# EAGLE design HAB (EAGLE 8.7.1)
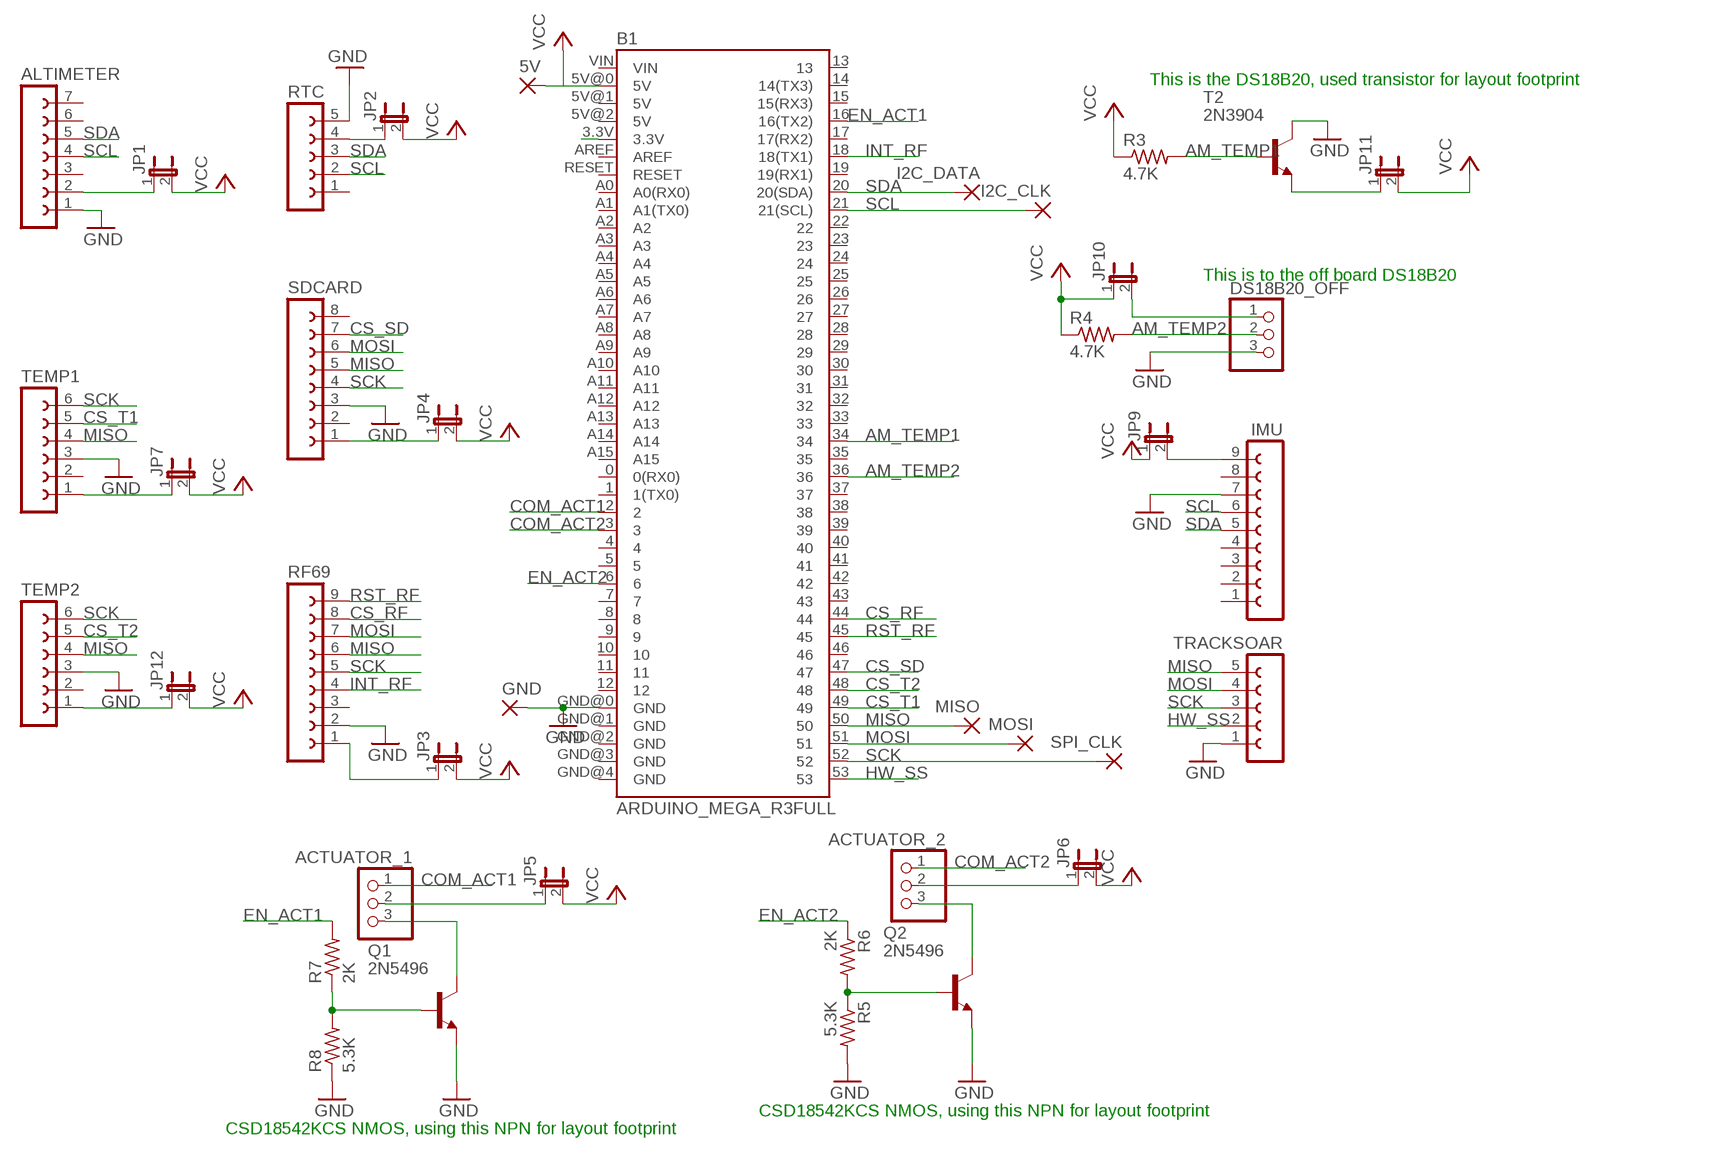
[diagram p0: schematic, sheet 1]

## Parts
5V  1,6/0,8  [1,6/0,8]
ACTUATOR_1  PINHD-1X3  [1X03]
ACTUATOR_2  PINHD-1X3  [1X03]
ALTIMETER  FE07-1  [FE07]
B1  ARDUINO_MEGA_R3FULL  [ARDUINO_MEGA]
DS18B20_OFF  PINHD-1X3  [1X03]
GND  1,6/0,8  [1,6/0,8]
I2C_CLK  1,6/0,8  [1,6/0,8]
I2C_DATA  1,6/0,8  [1,6/0,8]
IMU  FE09-1  [FE09]
JP1  JP1E  [JP1]
JP2  JP1E  [JP1]
JP3  JP1E  [JP1]
JP4  JP1E  [JP1]
JP5  JP1E  [JP1]
JP6  JP1E  [JP1]
JP7  JP1E  [JP1]
JP9  JP1E  [JP1]
JP10  JP1E  [JP1]
JP11  JP1E  [JP1]
JP12  JP1E  [JP1]
MISO  1,6/0,8  [1,6/0,8]
MOSI  1,6/0,8  [1,6/0,8]
Q1  2N5496  [TO220]
Q2  2N5496  [TO220]
R3  4.7K  R-US_0207/10  [0207/10]
R4  4.7K  R-US_0207/10  [0207/10]
R5  5.3K  R-US_0207/10  [0207/10]
R6  2K  R-US_0207/10  [0207/10]
R7  2K  R-US_0207/10  [0207/10]
R8  5.3K  R-US_0207/10  [0207/10]
RF69  FE09-1  [FE09]
RTC  FE05-1  [FE05-1]
SDCARD  FE08-1  [FE08]
SPI_CLK  1,6/0,8  [1,6/0,8]
T2  2N3904  [TO92]
TEMP1  FE06-1  [FE06]
TEMP2  FE06-1  [FE06]
TRACKSOAR  FE05-1  [FE05-1]

## Nets
AM_TEMP1: B1.34 R3.2 T2.2(B)
AM_TEMP2: B1.36 DS18B20_OFF.2 R4.2
COM_ACT1: ACTUATOR_1.1 B1.2
COM_ACT2: ACTUATOR_2.1 B1.3
CS_RF: B1.44 RF69.8
CS_SD: B1.47 SDCARD.7
CS_T1: B1.49 TEMP1.5
CS_T2: B1.48 TEMP2.5
EN_ACT1: B1.16(16(TX2)) R7.2
EN_ACT2: B1.6 R6.1
GND: ALTIMETER.1 B1.GND@0(GND) DS18B20_OFF.3 GND.1(P) IMU.7 Q1.3(E) Q2.3(E) R5.2 R8.1 RF69.2 RTC.5 SDCARD.3 T2.1(C) TEMP1.3 TEMP2.3 TRACKSOAR.1
HW_SS: B1.53 TRACKSOAR.2
INT_RF: B1.18(18(TX1)) RF69.4
MISO: B1.50 MISO.1(P) RF69.6 SDCARD.5 TEMP1.4 TEMP2.4 TRACKSOAR.5
MOSI: B1.51 MOSI.1(P) RF69.7 SDCARD.6 TRACKSOAR.4
N$1: Q2.1(B) R5.1 R6.2
N$2: DS18B20_OFF.1 JP10.2
N$3: ACTUATOR_2.3 Q2.2(C)
N$4: Q1.1(B) R7.1 R8.2
N$5: ACTUATOR_1.3 Q1.2(C)
N$6: JP3.1 RF69.1
N$7: JP7.1 TEMP1.1
N$8: JP12.1 TEMP2.1
N$11: ALTIMETER.2 JP1.1
N$12: JP2.1 RTC.4
N$13: JP4.1 SDCARD.1
N$16: ACTUATOR_1.2 JP5.1
N$17: ACTUATOR_2.2 JP6.1
N$20: IMU.9 JP9.2
N$25: JP11.1 T2.3(E)
N$29: B1.3.3V
RST_RF: B1.45 RF69.9
SCK: B1.52 RF69.5 SDCARD.4 SPI_CLK.1(P) TEMP1.6 TEMP2.6 TRACKSOAR.3
SCL: ALTIMETER.4 B1.21(21(SCL)) I2C_CLK.1(P) IMU.6 RTC.2
SDA: ALTIMETER.5 B1.20(20(SDA)) I2C_DATA.1(P) IMU.5 RTC.3
VCC: 5V.1(P) B1.5V@0(5V) JP1.2 JP2.2 JP3.2 JP4.2 JP5.2 JP6.2 JP7.2 JP9.1 JP10.1 JP11.2 JP12.2 R3.1 R4.1
Unconnected: ALTIMETER.3 ALTIMETER.6 ALTIMETER.7 B1.0(0(RX0)) B1.1(1(TX0)) B1.4 B1.5 B1.5V@1(5V) B1.5V@2(5V) B1.7 B1.8 B1.9 B1.10 B1.11 B1.12 B1.13 B1.14(14(TX3)) B1.15(15(RX3)) B1.17(17(RX2)) B1.19(19(RX1)) B1.22 B1.23 B1.24 B1.25 B1.26 B1.27 B1.28 B1.29 B1.30 B1.31 B1.32 B1.33 B1.35 B1.37 B1.38 B1.39 B1.40 B1.41 B1.42 B1.43 B1.46 B1.A0(A0(RX0)) B1.A1(A1(TX0)) B1.A2 B1.A3 B1.A4 B1.A5 B1.A6 B1.A7 B1.A8 B1.A9 B1.A10 B1.A11 B1.A12 B1.A13 B1.A14 B1.A15 B1.AREF B1.GND@1(GND) B1.GND@2(GND) B1.GND@3(GND) B1.GND@4(GND) B1.RESET B1.VIN IMU.1 IMU.2 IMU.3 IMU.4 IMU.8 RF69.3 RTC.1 SDCARD.2 SDCARD.8 TEMP1.2 TEMP2.2

## Notes on the sheet
- This is the DS18B20, used transistor for layout footprint
- This is to the off board DS18B20
- CSD18542KCS NMOS, using this NPN for layout footprint
- CSD18542KCS NMOS, using this NPN for layout footprint

## Library data of the parts
5V GND I2C_CLK I2C_DATA MISO MOSI SPI_CLK = wirepad:1,6/0,8: THROUGH-HOLE PAD
ACTUATOR_1 ACTUATOR_2 DS18B20_OFF = adafruit:PINHD-1X3: PIN HEADER
ALTIMETER = con-lsta:FE07-1: FEMALE HEADER; OC_FARNELL: unknown; OC_NEWARK: unknown
B1 = SparkFun-Boards:ARDUINO_MEGA_R3: Arduino Mega R3 ATmega2560 R3 compatible footprint. SparkFun Products: Arduino Mega 2560 R3 <https://www.sparkfun.com/products/11061>
IMU RF69 = con-lsta:FE09-1: FEMALE HEADER; OC_FARNELL: unknown; OC_NEWARK: unknown
JP1-JP7 JP9-JP12 = jumper:JP1E: JUMPER
Q1 Q2 = transistor-npn:2N5496: NPN Transistor
R3-R8 = rcl:R-US_: RESISTOR, American symbol; SPICEPREFIX: R
RTC TRACKSOAR = con-lsta:FE05-1: FEMALE HEADER; OC_FARNELL: unknown; OC_NEWARK: unknown
SDCARD = con-lsta:FE08-1: FEMALE HEADER; OC_FARNELL: unknown; OC_NEWARK: unknown
T2 = transistor:2N3904: NPN TRANSISTOR
TEMP1 TEMP2 = con-lsta:FE06-1: FEMALE HEADER; OC_FARNELL: unknown; OC_NEWARK: unknown

## Board
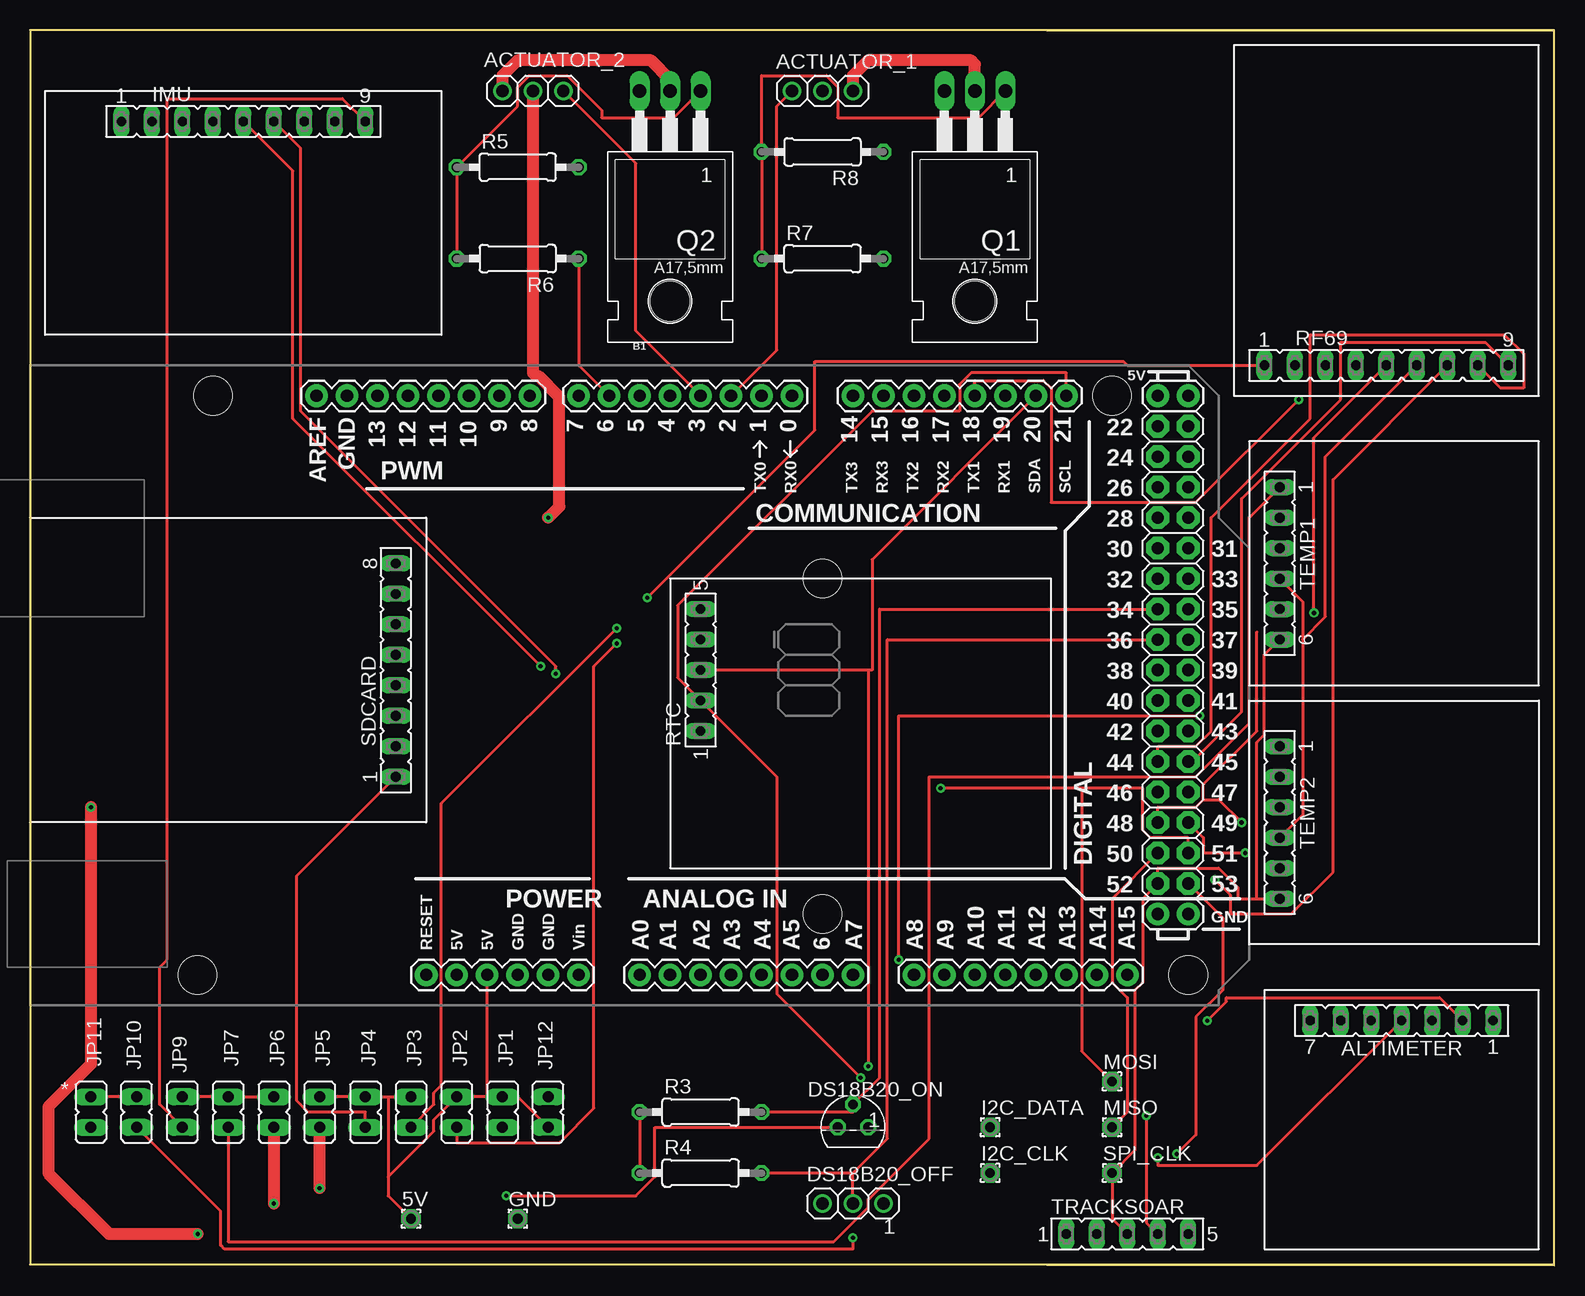
[diagram p1: board, top side]
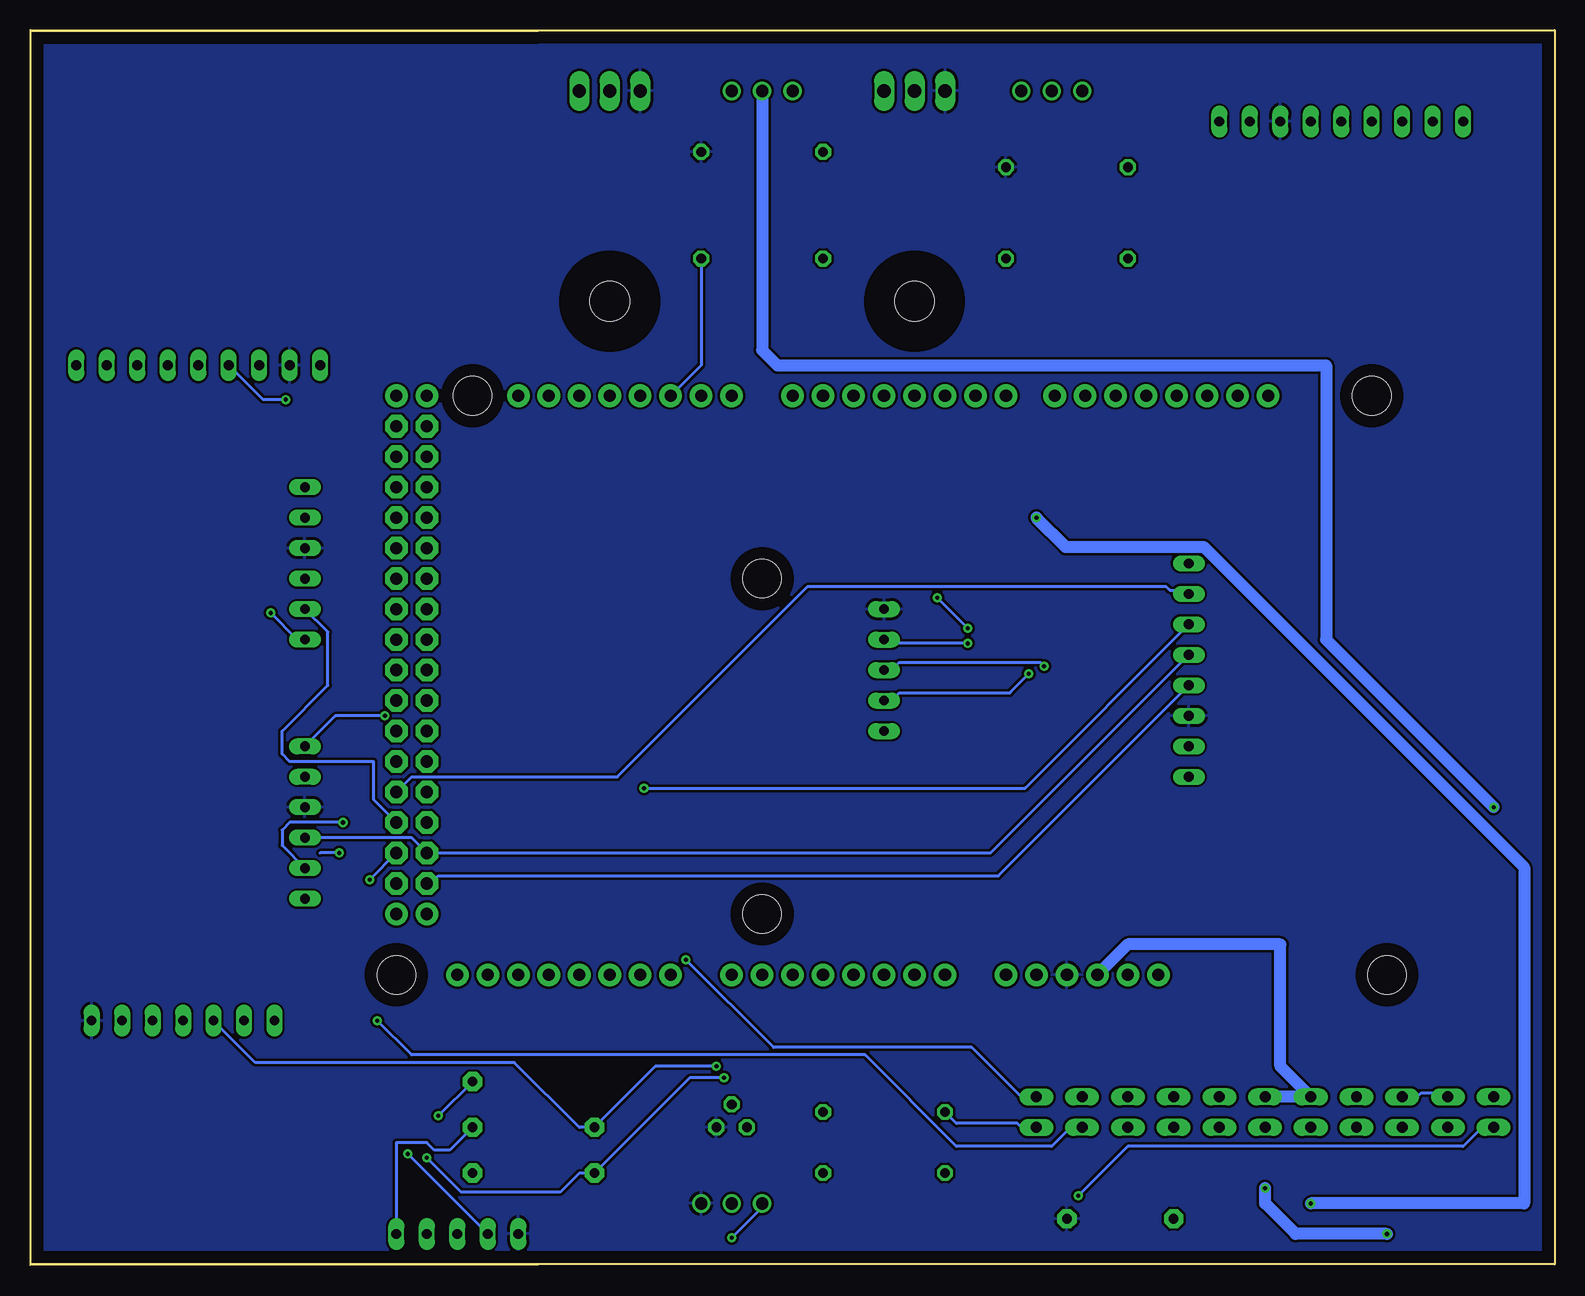
[diagram p2: board, bottom side, seen from below]

Size 127.05 x 103 mm. Coordinates in mm from the lower left corner, seen from the top.
Outline: 0,0.13 127.05,0 127.05,102.86 0,102.99 0,0.13
Outline: 0,0.13 0,103 127,103 127,0.13 0,0.13
Copper layers (1*16): Top 0.035mm / dielectric 1.5mm / Bottom 0.035mm
Design rules "default *": minimum track width 10mil, minimum drill 0.35mm, track to track 8mil, track to pad 8mil, pad to pad 8mil, via to via 8mil, smd to smd 6mil, copper to edge 40mil, drill to drill 6mil, minimum pad ring 10mil, minimum via ring 8mil, stop-mask expansion 4mil, vias tented up to drill 0mil, thermal gap 10mil

### Footprints (pad centres in the part's own frame; a part is rotated, then mirrored left to right if it is on the bottom)
1,6/0,8 = drill 0.813 pad 1.6 octagon: 1 0,0
1X03 = drill 1.016: 1 -2.54,0; 2 0,0; 3 2.54,0
FE07 = drill 0.813 long: 1 -7.62,0; 2 -5.08,0; 3 -2.54,0; 4 0,0; 5 2.54,0; 6 5.08,0; 7 7.62,0
ARDUINO_MEGA = drill 1.016 pad 1.88: 0 13.97,24.13; 1 11.43,24.13; 2 8.89,24.13; 3 6.35,24.13; 3.3V -13.97,-24.13; 4 3.81,24.13; 5 1.27,24.13; 5V@0 -11.43,-24.13; 5V@1 44.45,24.13; 5V@2 46.99,24.13; 6 -1.27,24.13; 7 -3.81,24.13; 8 -7.874,24.13; 9 -10.414,24.13; 10 -12.954,24.13; 11 -15.494,24.13; 12 -18.034,24.13; 13 -20.574,24.13; 14 19.05,24.13; 15 21.59,24.13; 16 24.13,24.13; 17 26.67,24.13; 18 29.21,24.13; 19 31.75,24.13; 20 34.29,24.13; 21 36.83,24.13; A0 1.27,-24.13; A1 3.81,-24.13; A2 6.35,-24.13; A3 8.89,-24.13; A4 11.43,-24.13; A5 13.97,-24.13; A6 16.51,-24.13; A7 19.05,-24.13; A8 24.13,-24.13; A9 26.67,-24.13; A10 29.21,-24.13; A11 31.75,-24.13; A12 34.29,-24.13; A13 36.83,-24.13; A14 39.37,-24.13; A15 41.91,-24.13; AREF -25.654,24.13; GND@0 -8.89,-24.13; GND@1 -6.35,-24.13; GND@2 44.45,-19.05; GND@3 46.99,-19.05; GND@4 -23.114,24.13; RESET -16.51,-24.13; VIN -3.81,-24.13 | drill 1.016 pad 1.88 octagon: 22 44.45,21.59; 23 46.99,21.59; 24 44.45,19.05; 25 46.99,19.05; 26 44.45,16.51; 27 46.99,16.51; 28 44.45,13.97; 29 46.99,13.97; 30 44.45,11.43; 31 46.99,11.43; 32 44.45,8.89; 33 46.99,8.89; 34 44.45,6.35; 35 46.99,6.35; 36 44.45,3.81; 37 46.99,3.81; 38 44.45,1.27; 39 46.99,1.27; 40 44.45,-1.27; 41 46.99,-1.27; 42 44.45,-3.81; 43 46.99,-3.81; 44 44.45,-6.35; 45 46.99,-6.35; 46 44.45,-8.89; 47 46.99,-8.89; 48 44.45,-11.43; 49 46.99,-11.43; 50 44.45,-13.97; 51 46.99,-13.97; 52 44.45,-16.51; 53 46.99,-16.51 | hole 3.2: -34.29,24.13; -35.56,-24.13; 16.51,8.89; 16.51,-19.05; 40.64,24.13; 46.99,-24.13
FE09 = drill 0.813 long: 1 -10.16,0; 2 -7.62,0; 3 -5.08,0; 4 -2.54,0; 5 0,0; 6 2.54,0; 7 5.08,0; 8 7.62,0; 9 10.16,0
JP1 = drill 0.914 long: 1 0,-1.27; 2 0,1.27
TO220 = drill 1.118 long: 1 -2.54,-6.35; 2 0,-6.35; 3 2.54,-6.35 | hole 3.302: 0,11.176
0207/10 = drill 0.813 octagon: 1 -5.08,0; 2 5.08,0
FE05-1 = drill 0.813 long: 1 -5.08,0; 2 -2.54,0; 3 0,0; 4 2.54,0; 5 5.08,0
FE08 = drill 0.813 long: 1 -8.89,0; 2 -6.35,0; 3 -3.81,0; 4 -1.27,0; 5 1.27,0; 6 3.81,0; 7 6.35,0; 8 8.89,0
TO92 = drill 0.813 octagon: 1 1.27,0; 2 0,1.905; 3 -1.27,0
FE06 = drill 0.813 long: 1 -6.35,0; 2 -3.81,0; 3 -1.27,0; 4 1.27,0; 5 3.81,0; 6 6.35,0

### Placement (x,y rotation side)
5V  31.75,3.94 0 top
ACTUATOR_1  66.04,97.92 0 top
ACTUATOR_2  41.91,97.92 180 top
ALTIMETER  114.3,20.45 180 top
B1  49.53,48.39 0 top
DS18B20_OFF  68.58,5.21 0 top
GND  40.64,3.94 0 top
I2C_CLK  80.01,7.75 0 top
I2C_DATA  80.01,11.56 0 top
IMU  17.78,95.38 0 top
JP1  39.37,12.83 0 top
JP2  35.56,12.83 0 top
JP3  31.75,12.83 0 top
JP4  27.94,12.83 0 top
JP5  24.13,12.83 0 top
JP6  20.32,12.83 0 top
JP7  16.51,12.83 0 top
JP9  12.7,12.83 180 top
JP10  8.89,12.83 180 top
JP11  5.08,12.83 0 top
JP12  43.18,12.83 180 top
MISO  90.17,11.56 0 top
MOSI  90.17,15.37 0 top
Q1  78.74,91.57 180 top
Q2  53.34,91.57 180 top
R3  55.88,12.83 0 top
R4  55.88,7.75 0 top
R5  40.64,91.57 0 top
R6  40.64,83.95 180 top
R7  66.04,83.95 0 top
R8  66.04,92.84 180 top
RF69  113.03,75.06 0 top
RTC  55.88,49.66 90 top
SDCARD  30.48,49.66 90 top
SPI_CLK  90.17,7.75 0 top
T2  68.58,11.56 0 top
TEMP1  104.14,58.55 270 top
TEMP2  104.14,36.96 270 top
TRACKSOAR  91.44,2.67 0 top

### Tracks (layer width: path | path; a pad name or v marks a point on that pad's centre or on a via)
AM_TEMP1
  Top 0.254: R3.2 68.58,12.83 T2.2 70.8,15.68 70.8,54.74 B1.34
AM_TEMP2
  Top 0.254: 68.58,7.75 R4.2 | DS18B20_OFF.2 68.58,7.75 | B1.36 71.44,52.2 71.44,10.6 68.58,7.75
COM_ACT1
  Top 0.254: ACTUATOR_1.1 62.23,96.65 62.23,76.33 B1.2
COM_ACT2
  Top 0.254: ACTUATOR_2.1 50.48,91.88 50.48,77.91 B1.3
CS_RF
  Top 0.254: RF69.8 122.56,73.15 124.46,73.15 124.46,76.01 122.87,77.6 106.68,77.6 106.68,70.61 98.43,62.36 98.43,44.58 97.16,43.31 93.98,43.31 B1.44
CS_SD
  Bottom 0.254: SDCARD.7 30.8,56.32 32.07,56.32 32.38,56.64 62.23,56.64 78.1,40.77 95.25,40.77 B1.47
CS_T1  (via drill 0.35)
  Top 0.254: v101.28,34.42 97.79,34.42 97.79,35.69 B1.49
  Bottom 0.254: v101.28,34.42 102.87,34.42 | TEMP1.5 102.24,52.83 102.24,48.39 106.04,44.58 106.04,42.67 105.41,42.04 98.43,42.04 98.43,38.86 B1.49
CS_T2  (via drill 0.35)
  Top 0.254: 102.24,52.83 102.24,44.58 97.79,40.13 97.79,38.86 | 97.79,38.86 97.16,38.23 93.98,38.23 B1.48 | v100.97,36.96 99.06,38.86 97.79,38.86
  Bottom 0.254: TEMP2.5 106.04,35.05 106.04,36.32 105.41,36.96 v100.97,36.96
EN_ACT1
  Bottom 0.254: R7.2 71.12,75.06 B1.16
EN_ACT2
  Top 0.254: R6.1 45.72,75.06 B1.6
GND
  pour Bottom: 0,101.73 127,101.73 127,0.13 0,0.13
HW_SS  (via drill 0.35)
  Top 0.254: v95.57,9.33 97.16,10.92 97.16,20.77 99.38,22.99 99.38,29.02 B1.53
  Bottom 0.254: v95.57,9.33 TRACKSOAR.2
INT_RF  (via drill 0.35)
  Top 0.254: v105.73,72.2 97.16,63.63 85.09,63.63 85.09,73.15 84.46,73.79 78.74,73.79 B1.18
  Bottom 0.254: RF69.4 107.63,72.2 v105.73,72.2
MISO
  Top 0.254: TEMP2.4 106.04,37.59 106.04,52.2 | 106.04,52.2 106.04,55.37 TEMP1.4 | RF69.6 107.95,67.44 107.95,54.1 106.04,52.2 | MISO.1 91.44,12.83 91.44,22.35 90.17,23.62 90.17,30.61 B1.50
  Bottom 0.254: TRACKSOAR.5 96.52,10.29 93.98,10.29 93.34,9.65 92.07,9.65 MISO.1 | SDCARD.5 46.99,34.42 B1.50 95.25,35.69 TEMP2.4
MOSI  (via drill 0.35)
  Top 0.254: TRACKSOAR.4 93.03,3.62 v93.03,12.51 | 87.63,39.81 92.71,39.81 92.71,36.32 93.34,35.69 96.52,35.69 B1.51 | 87.63,39.81 v75.88,39.81 | RF69.7 108.59,65.53 108.59,32.83 105.09,29.34 100.01,29.34 100.01,30.92 v98.74,32.19 | MOSI.1 87.63,17.91 87.63,39.81
  Bottom 0.254: MOSI.1 v93.03,12.51 | SDCARD.6 44.13,39.81 v75.88,39.81 | B1.51 v98.74,32.19
N$1
  Top 0.254: R6.2 R5.1 40.64,96.65 40.64,98.23 41.59,99.19 44.77,99.19 47.62,96.33 47.62,95.69 53.66,95.69 Q2.1
N$2  (via drill 0.35)
  Top 0.254: JP10.2 15.88,4.57 15.88,1.71 16.19,1.4 68.58,1.4 v68.58,2.35
  Bottom 0.254: v68.58,2.35 66.04,4.89 DS18B20_OFF.1
N$3
  Top 1.016: Q2.2 53.34,98.87 51.75,100.46 40.64,100.46 39.37,99.19 ACTUATOR_2.3
N$4
  Top 0.254: R7.1 R8.2 60.96,99.19 66.36,99.19 67.31,98.23 67.31,95.69 79.06,95.69 Q1.1
N$5
  Top 1.016: Q1.2 78.74,100.14 78.42,100.46 69.85,100.46 68.58,99.19 ACTUATOR_1.3
N$6  (via drill 0.35)
  Top 0.254: RF69.1 91.44,75.06 91.12,75.38 65.41,75.38 65.41,69.66 v51.44,55.69 | v48.9,53.15 34.29,38.54 34.29,15.05 33.66,14.41 33.66,13.46 JP3.1
  Bottom 0.254: v48.9,53.15 v51.44,55.69
N$7
  Top 0.254: TEMP1.1 101.6,62.36 101.6,45.21 97.16,40.77 74.93,40.77 74.93,10.6 69.85,5.52 69.85,4.89 66.99,2.03 16.51,2.03 JP7.1
N$8  (via drill 0.35)
  Top 0.254: v97.47,45.85 72.39,45.85 v72.39,25.53
  Bottom 0.254: TEMP2.1 101.6,45.85 v97.47,45.85 | v72.39,25.53 65.09,18.22 48.58,18.22 44.45,14.1 JP12.1
N$11  (via drill 0.35)
  Top 0.254: ALTIMETER.2 117.47,22.35 99.69,22.35 99.69,22.04 v98.11,20.45
  Bottom 0.254: v98.11,20.45 95.25,17.59 57.47,17.59 49.85,9.97 41.91,9.97 40.32,11.56 JP1.1
N$12  (via drill 0.35)
  Top 0.254: v48.9,51.88 46.99,49.97 46.99,13.14 44.13,10.29 35.56,10.29 JP2.1
  Bottom 0.254: RTC.4 55.56,51.88 v48.9,51.88
N$13
  Top 0.254: SDCARD.1 22.23,32.51 22.23,13.78 23.18,12.83 27.94,12.83 JP4.1
N$16  (via drill 0.35)
  Top 1.016: v5.08,38.23 5.08,16.82 1.52,13.26 1.52,7.75 6.6,2.67 v13.97,2.67 | v24.13,6.48 JP5.1
  Bottom 1.016: ACTUATOR_1.2 66.04,76.33 64.77,75.06 19.05,75.06 19.05,52.2 v5.08,38.23 | v13.97,2.67 21.59,2.67 24.13,5.21 v24.13,6.48
N$17  (via drill 0.35)
  Top 1.016: ACTUATOR_2.2 41.91,74.42 42.16,74.17 42.34,74.17 44.07,72.44 44.07,63.37 44.13,63.31 v43.18,62.36 | JP6.1 v20.32,5.21
  Bottom 1.016: v43.18,62.36 40.74,59.92 29.25,59.92 2.54,33.21 2.54,5.21 v20.32,5.21
N$20
  Top 0.254: IMU.9 26.04,97.28 11.43,97.28 11.43,25.53 10.79,24.89 10.79,13.46 JP9.2
N$25  (via drill 0.35)
  Top 0.254: T2.3 52.07,11.56 52.07,7.43 50.48,5.84 v39.69,5.84
  Bottom 0.254: v39.69,5.84 35.56,9.97 7.62,9.97 6.03,11.56 JP11.1
RST_RF
  Top 0.254: RF69.9 121.28,76.96 109.22,76.96 109.22,72.2 100.97,63.94 100.97,46.17 96.84,42.04 B1.45
SCK  (via drill 0.35)
  Top 0.254: TRACKSOAR.3 90.17,3.94 SPI_CLK.1 92.07,9.65 92.07,22.99 92.71,23.62 92.71,30.61 B1.52 93.98,33.15 99.06,33.15 100.65,31.56 100.65,30.61 102.24,30.61 | 102.24,30.61 TEMP2.6 | TEMP1.6 102.87,50.93 102.87,44.26 102.24,43.62 102.24,30.61 | RF69.5 107,69.03 v107,54.42
  Bottom 0.254: SDCARD.4 46.35,32.51 93.03,32.51 93.66,31.88 B1.52 | v107,54.42 104.78,52.2 TEMP1.6
SCL  (via drill 0.35)
  Top 0.254: ALTIMETER.4 102.24,8.38 93.98,8.38 v93.98,9.02 | B1.21 86.36,74.42 78.42,74.42 77.47,73.47 77.47,71.25 70.17,71.25 53.98,55.05 53.98,49.02 RTC.2 62.23,40.77 62.23,22.67 v69.22,15.68 | IMU.6 22.54,93.16 22.54,71.25 43.81,49.97 v43.81,49.34
  Bottom 0.254: v93.98,9.02 91.12,6.16 82.87,6.16 81.28,7.75 I2C_CLK.1 72.07,15.68 v69.22,15.68 | v43.81,49.34 45.4,47.75 54.61,47.75 55.24,47.12 RTC.2
SDA  (via drill 0.35)
  Top 0.254: 69.85,49.66 70.17,49.66 70.17,58.86 B1.20 | 69.85,49.66 RTC.3 | IMU.5 21.91,91.25 21.91,70.61 v42.55,49.97 | 69.85,49.66 v69.85,16.64
  Bottom 0.254: ALTIMETER.5 108.27,16.95 86.68,16.95 81.28,11.56 I2C_DATA.1 74.93,16.64 v69.85,16.64 | v42.55,49.97 42.86,50.29 54.61,50.29 55.24,49.66 RTC.3
VCC
  Top 0.254: R3.1 R4.1 | 38.1,14.1 JP2.2 33.66,12.19 33.66,11.24 29.84,7.43 | JP12.2 40.64,14.1 JP1.2 38.1,14.1 | 38.1,14.1 B1.5V@0 | JP10.1 JP11.2 | JP9.1 JP7.2 JP6.2 | JP5.2 JP4.2 29.84,14.1 | 29.84,14.1 JP3.2 | 5V.1 29.84,5.84 29.84,7.43 | 29.84,14.1 29.84,7.43
  Bottom 0.254: R3.1 49.85,11.87 44.77,11.87 44.45,11.56 JP12.2 | JP10.1 9.21,14.41 11.11,14.41 11.43,14.1 JP9.1
  Bottom 1.016: B1.5V@0 35.56,26.8 22.86,26.8 22.86,16.64 JP6.2 JP5.2

### Text on the board
tPlace: 1 | 1 | * | DS18B20_ON | 1 | 1